# Altium project Flash Pmod.PrjPcb
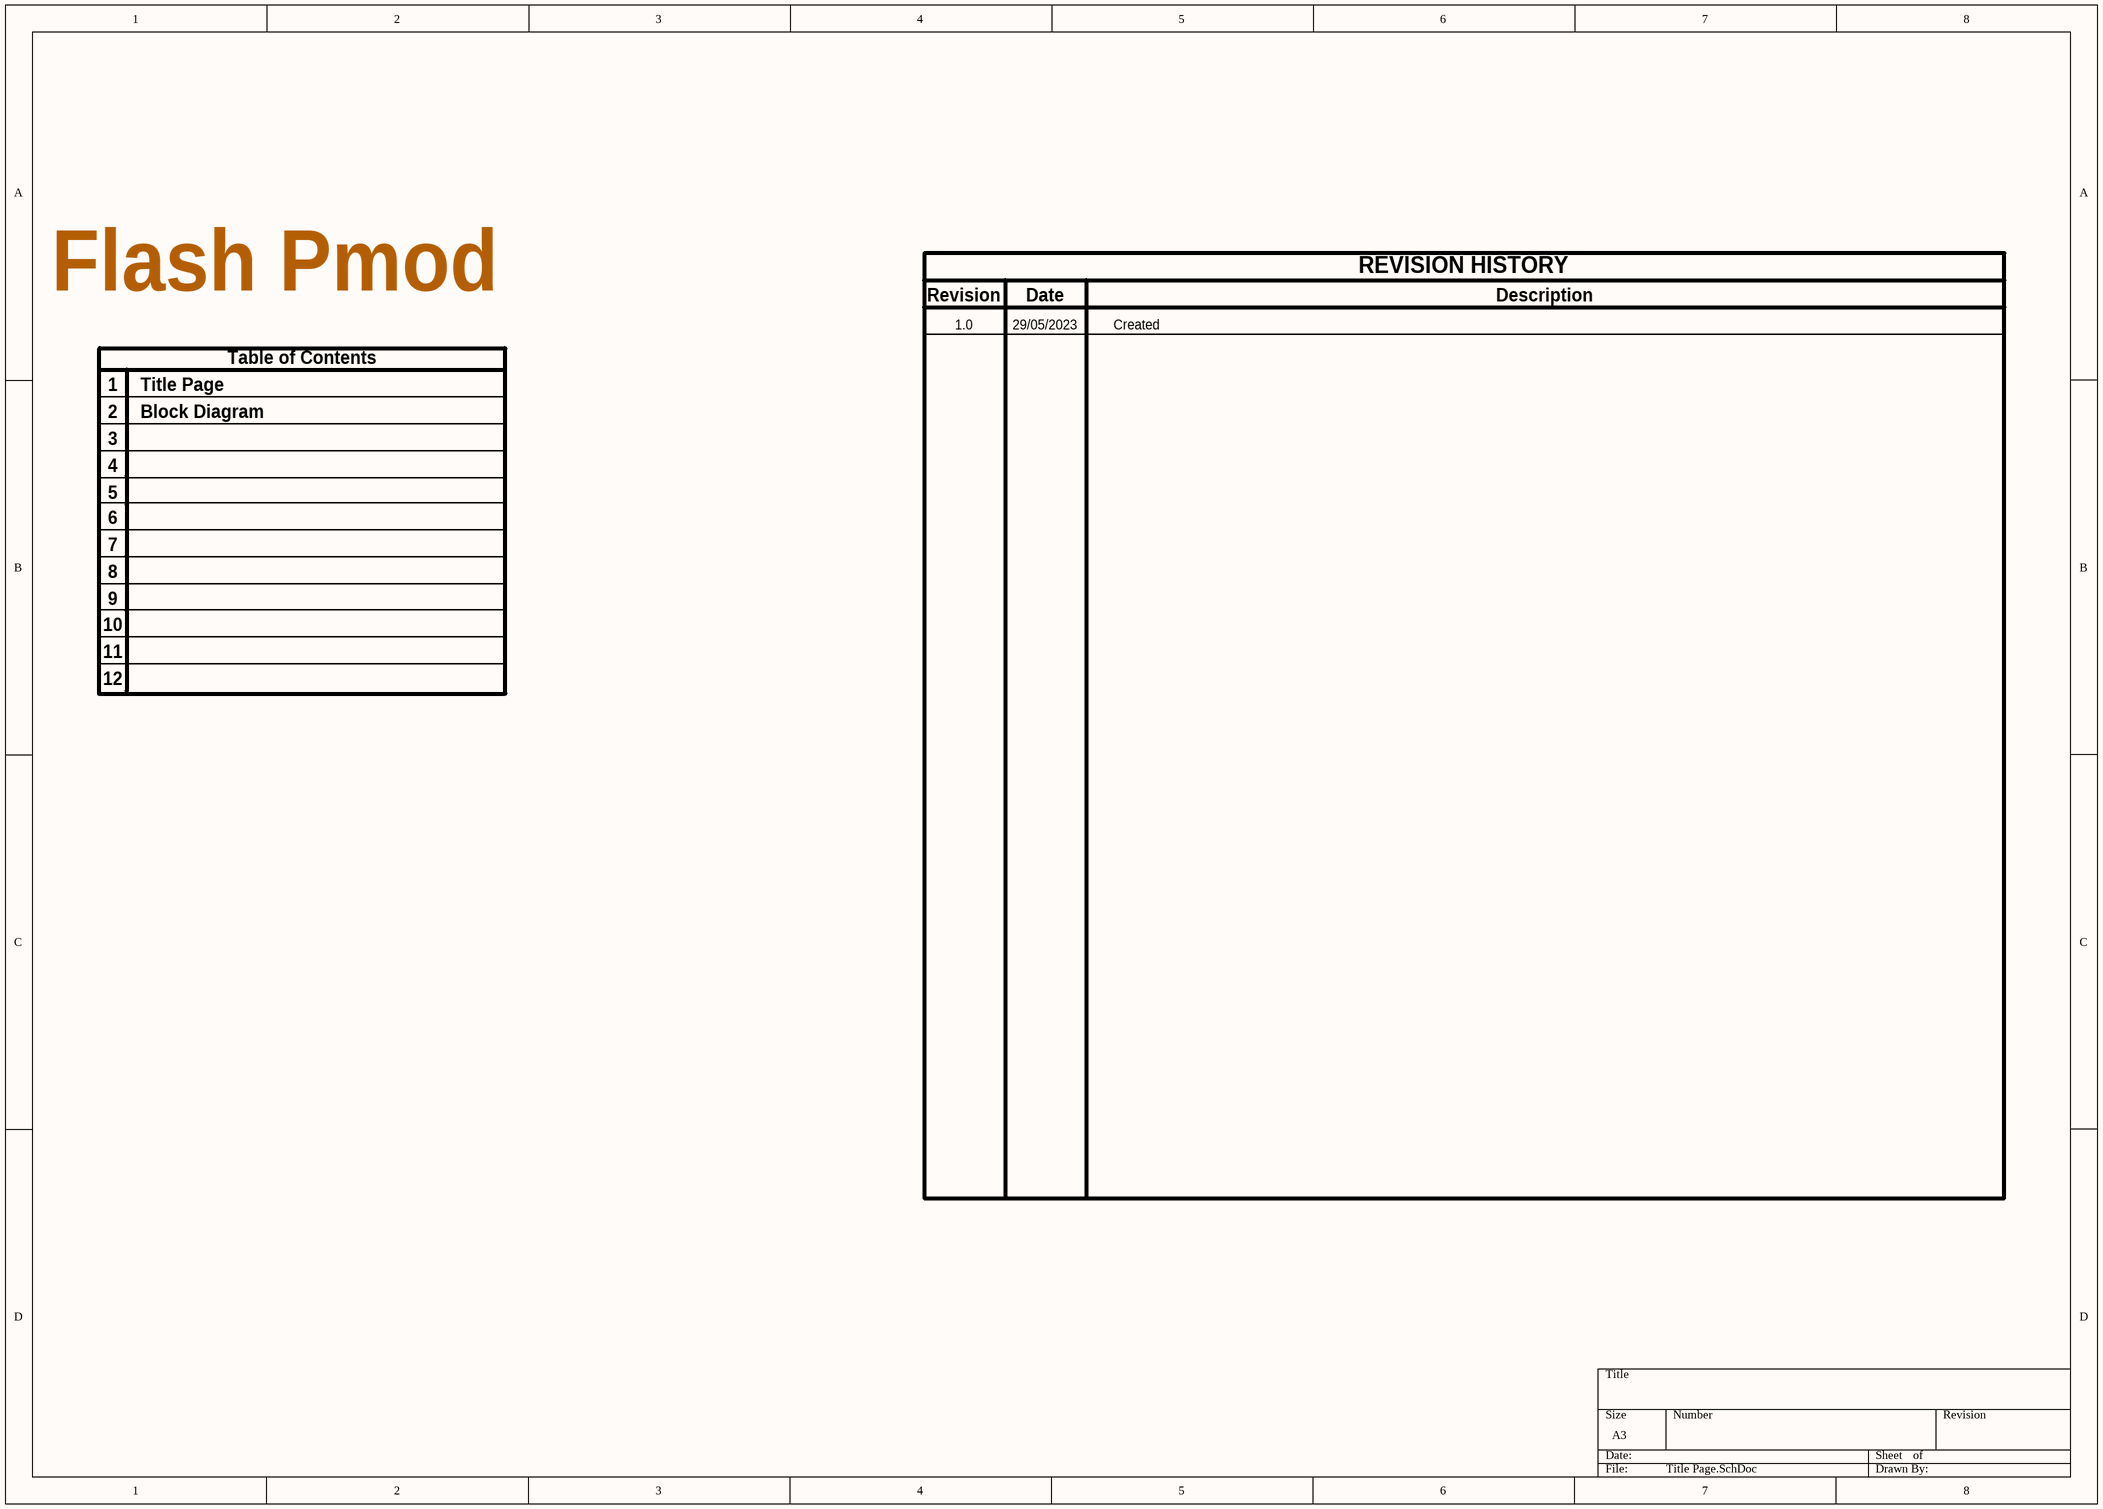
[diagram p0: Title Page.SchDoc]
2 sheets, 13 parts. Net scope: global (net labels, ports and power ports of the same name join across sheets).
Board file: Flash Pmod.PcbDoc
Sheets:
  Title Page.SchDoc
  Flash.SchDoc

## Sheet Title Page.SchDoc
size A3; SheetNumber: 1; SheetTotal: 2

### Notes on the sheet
- Flash Pmod
- Revision
- Date
- REVISION HISTORY
- Description
- Table of Contents
- 1.0
- 29/05/2023
- Created
- 1
- 2
- 3
- Title Page
- Block Diagram
- 4
- 5
- 6
- 7
- 8
- 9
- 10
- 11
- 12

## Sheet Flash.SchDoc
size A3; SheetNumber: 2; SheetTotal: 2
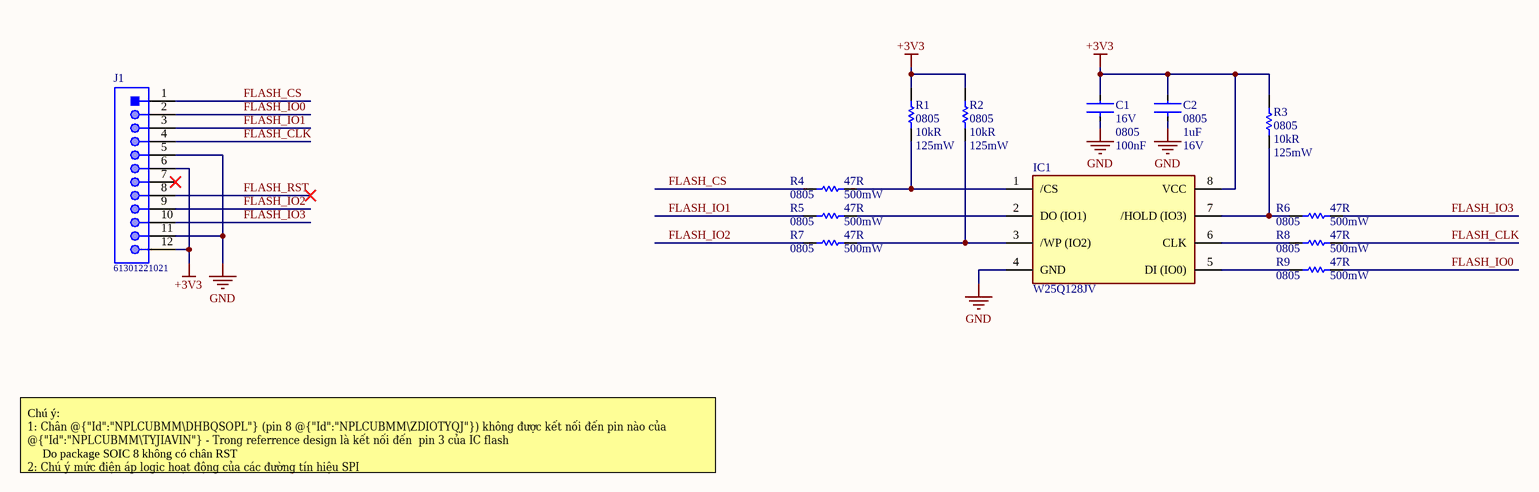
[diagram p1: Flash.SchDoc]

### Parts
C1  Voltage Rating: 16V  Case Code (Imperial): 0805  Capacitance: 100nF  [FP-0805-L_2_01_0_2-W_1_25-IPC_B]  (hidden comment: 08051C104KAT2A)
C2  value 1uF  Case/Package: 0805  Voltage Rating: 16V  [FP-0805-L_2_01_0_2-W_1_25-IPC_B]  (hidden comment: C0805C105K4PACTU)
IC1  W25Q128JV  [SOIC127P790X216-8N]
J1  61301221021  [61301221021]
R1  value 10kR  Case/Package: 0805  Power Rating: 125mW  [RESC2013X70X40LL20T20]  (hidden comment: RC0805FR-0710KL)
R2  value 10kR  Case/Package: 0805  Power Rating: 125mW  [RESC2013X70X40LL20T20]  (hidden comment: RC0805FR-0710KL)
R3  value 10kR  Case/Package: 0805  Power Rating: 125mW  [RESC2013X70X40LL20T20]  (hidden comment: RC0805FR-0710KL)
R4  value 47R  Case Code (Imperial): 0805  Power Rating: 500mW  [RESC2013X70X40LL20T20]  (hidden comment: ERJ-P6WF47R0V)
R5  value 47R  Case Code (Imperial): 0805  Power Rating: 500mW  [RESC2013X70X40LL20T20]  (hidden comment: ERJ-P6WF47R0V)
R6  value 47R  Case Code (Imperial): 0805  Power Rating: 500mW  [RESC2013X70X40LL20T20]  (hidden comment: ERJ-P6WF47R0V)
R7  value 47R  Case Code (Imperial): 0805  Power Rating: 500mW  [RESC2013X70X40LL20T20]  (hidden comment: ERJ-P6WF47R0V)
R8  value 47R  Case Code (Imperial): 0805  Power Rating: 500mW  [RESC2013X70X40LL20T20]  (hidden comment: ERJ-P6WF47R0V)
R9  value 47R  Case Code (Imperial): 0805  Power Rating: 500mW  [RESC2013X70X40LL20T20]  (hidden comment: ERJ-P6WF47R0V)

### Nets
+3V3: C1.2 C2.2 IC1.8(VCC) J1.6 J1.12 R1.1 R2.1 R3.1
GND: C1.1 C2.1 IC1.4(GND) J1.5 J1.11
FLASH_CLK: J1.4 R8.1
FLASH_CS: J1.1 R4.2
FLASH_IO0: J1.2 R9.1
FLASH_IO1: J1.3 R5.2
FLASH_IO2: J1.9 R7.2
FLASH_IO3: J1.10 R6.1
FLASH_RST: J1.8
NetIC1_1: IC1.1(/CS) R1.2 R4.1
NetIC1_2: IC1.2(DO_(IO1)) R5.1
NetIC1_3: IC1.3(/WP_(IO2)) R2.2 R7.1
NetIC1_5: IC1.5(DI_(IO0)) R9.2
NetIC1_6: IC1.6(CLK) R8.2
NetIC1_7: IC1.7(/HOLD_(IO3)) R3.2 R6.2

Not connected (* = marked no-connect by the designer): J1 7*

### Notes on the sheet
- Chú ý:
  1: Chân @{"Id":"NPLCUBMM\DHBQSOPL"} (pin 8 @{"Id":"NPLCUBMM\ZDIOTYQJ"}) không được kết nối đến pin nào của @{"Id":"NPLCUBMM\TYJIAVIN"} - Trong referrence design là kết nối đến  pin 3 của IC flash
  Do package SOIC 8 không có chân RST
  2: Chú ý mức điện áp logic hoạt động của các đường tín hiệu SPI

### Library data of the parts
C1 = CMP-2007-04174-2: General Purpose Ceramic Capacitor, 0805, 100nF, 10%, X7R, 15%, 100V; Manufacturer: Kyocera AVX; Packaging: Tape and Reel; Min Operating Temperature: -55°C; Dielectric Material: Ceramic; Height: 1.4mm; Termination: SMD/SMT; Case Code (Metric): 2012; Case/Package: 0805; Construction: Flat; Radiation Hardening: No; Series: -; Dielectric: X7R; Package Quantity: 2000; Mount: Surface Mount; Contact Plating: Tin; Voltage: 100V; Lead Free: Lead Free; Depth: 1.25mm; RoHS Compliant: Yes; Number of Pins: 2; Max Operating Temperature: 125°C; Length: 2.01mm; Voltage Rating (DC): 100V; Thickness: 0.055inch; REACH SVHC: No SVHC; Width: 0.049inch; Tolerance: 10%; Supplier: Digi-Key; Supplier Part Number: 478-5028-1-ND; Manufacturer Part Number: 08051C104KAT2A; RoHS: Yes; Category: Ceramic Capacitors; Stock: 469390; Pricing: 1=0,14, 10=0,103, 50=0,0584, 100=0,0483, 500=0,03388, 1000=0,02805 (USD); Mounting Technology: Surface Mount,PCB; Pins: 2; Value: 100nF; Reach SVHC Compliant: No
C2 = CMP-2007-04174-2: General Purpose Ceramic Capacitor, 0805, 100nF, 10%, X7R, 15%, 100V; Manufacturer: KEMET; Dielectric: X5R; Dissipation Factor: 5%; Supplier: Digi-Key; Supplier Part Number: 399-C0805C105K4PAC7800CT-ND; Manufacturer Part Number: C0805C105K4PACTU; RoHS: Yes; Category: Ceramic Capacitors; Stock: 66614; Pricing: 1=0,2, 10=0,136, 50=0,0814, 100=0,0687, 500=0,047, 1000=0,04158 (USD); Mounting Technology: Surface Mount,PCB; Case Code (Metric): 2012; Case Code (Imperial): 0805; Dielectric Material: Ceramic; Min Operating Temperature: -55°C; Max Operating Temperature: 85°C; Tolerance: 10%; Packaging: Tape and Reel; Termination: SMD/SMT; Series: C0805C; Voltage Rating (DC): 16V; Voltage: 16V; Package Quantity: 2500; Construction: Flat; Length: 2mm; Width: 1.2mm; Height: 1.25mm; Depth: 1.25mm; Thickness: 0.055inch; Radiation Hardening: No; Reach SVHC Compliant: No; RoHS Compliant: Yes; Lead Free: Lead Free
IC1 = W25Q128JVSIM_TR: Integrated Circuit; Manufacturer_Name: Winbond; Manufacturer_Part_Number: W25Q128JVSIM TR; Datasheet Link: http://www.winbond.com/resource-files/w25q128jv%20dtr%20revb%2011042016.pdf; Height: 2.16mm; Mouser Part Number: 454-W25Q128JVSIMTR; Mouser Price/Stock: https://www.mouser.co.uk/ProductDetail/Winbond/W25Q128JVSIM-TR?qs=qSfuJ%252Bfl%2Fd6ji9IuruL6Zg%3D%3D; Arrow Part Number: W25Q128JVSIM TR; Arrow Price/Stock: https://www.arrow.com/en/products/w25q128jvsimtr/winbond-electronics?region=nac
J1 = CMP-1502-01087-1: THT Angled Pin Header WR-PHD, Pitch 2.54 mm, Dual Row, 12 pins; Manufacturer: Wurth Electronics; Pitch: 2.54mm; Gender: Male; Pin Number: 12; Working Voltage: 250VAC; Withstanding Voltage: 500VAC; Contact Resistance: 20mOhm; Rated Current: 3A; Voltage Rating: 250V; Datasheet URL: https://katalog.we-online.de/em/datasheet/6130xx21021.pdf; Orientation: Angled; Package Reference: 61301221021; Operating Temperature: -40to105degC; Part Number: 61301221021; Mounting Technology: THT; Row Number: Dual; Publisher: WurthElektronik; Packaging: Bag; Manufacturer URL: http://www.we-online.de; Supplier: Digi-Key; Supplier Part Number: 732-5354-ND; Manufacturer Part Number: 61301221021; RoHS: Yes; Category: Connectors; Stock: 2535; Pricing: 1=0,96, 10=0,817, 25=0,6812, 50=0,568, 100=0,516, 1000=0,469 (USD); Contact Plating: Gold; Contact Material: Copper Alloy,Copper; Contact Shape: Square; Contact Finish - Mating: GOLD; Insulation Material: Nylon; Insulation Color: Black; Min Operating Temperature: -40°C; Max Operating Temperature: 105°C; Number of Rows: 2; Number of Positions: 12; Termination: Solder; Number of Contacts: 12; Connector Type: Header; Fastening Type: Pull; Series: WR-PHD; Contact Type: Male Pin; RoHS Compliant: Yes; Flammability Rating: UL94 V-0; Reach SVHC Compliant: Unknown; ComponentLink1URL: http://www.farnell.com/cad/1737270.pdf?src-supplier=Element14; ComponentLink1Description: http://www.farnell.com/cad/1737270.pdf?src-supplier=Element14; ComponentLink2URL: https://katalog.we-online.de/em/datasheet/6130xx21021.pdf?src-supplier=Digi-Key; ComponentLink2Description: https://katalog.we-online.de/em/datasheet/6130xx21021.pdf?src-supplier=Digi-Key
R1-R3 = CMP-2001-00486-1: 10 kOhms ±1% 0.125W, 1/8W Chip Resistor 0805 (2012 Metric) Moisture Resistant Thick Film; Manufacturer: Yageo; Voltage Rating: 150V; Temperature Coefficient: 100ppm/°C; Supplier: Digi-Key; Supplier Part Number: 311-10.0KCRCT-ND; Manufacturer Part Number: RC0805FR-0710KL; RoHS: Yes; Category: Chip SMD Resistors; Stock: 9862859; Pricing: 1=0,1, 10=0,027, 50=0,017, 100=0,0143, 500=0,00986, 1000=0,00852 (USD); Case Code (Imperial): 0805; Case Code (Metric): 2012; Min Operating Temperature: -55°C; Max Operating Temperature: 155°C; Packaging: Tape and Reel; Tolerance: 1%; Termination: SMD/SMT; Series: RC; Package Quantity: 1; Resistor Type: Thick Film; Number of Terminations: 2; Max Power Dissipation: 125mW; Features: Moisture Resistant; Construction: Rectangular; Resistance Tolerance: 1%; Technology: THICK FILM; Length: 0.079inch; Width: 0.049inch; Height: 0.024inch; Depth: 1.25mm; RoHS Compliant: Yes; Military Standard: Not; Lead Free: Lead Free; Reach SVHC Compliant: Unknown; ComponentLink1URL: https://datasheet.ciiva.com/11808/0900766b8106beab-11808151.pdf?src-supplier=Rs; ComponentLink1Description: https://datasheet.ciiva.com/11808/0900766b8106beab-11808151.pdf?src-supplier=Rs; ComponentLink2URL: https://datasheet.ciiva.com/46447/444164-46447563.pdf?src-supplier=Element14; ComponentLink2Description: https://datasheet.ciiva.com/46447/444164-46447563.pdf?src-supplier=Element14; ComponentLink3URL: https://datasheet.ciiva.com/2456/pyu-r-int-thick-7-2456973.pdf?src-supplier=Digi-Key; ComponentLink3Description: https://datasheet.ciiva.com/2456/pyu-r-int-thick-7-2456973.pdf?src-supplier=Digi-Key; ComponentLink4URL: https://datasheet.ciiva.com/2456/pyu-r-int-thick-7-2456974.pdf?src-supplier=Digi-Key; ComponentLink4Description: https://datasheet.ciiva.com/2456/pyu-r-int-thick-7-2456974.pdf?src-supplier=Digi-Key; ComponentLink5URL: https://datasheet.ciiva.com/2456/pyu-r-int-thick-7-2456972.pdf?src-supplier=Digi-Key; ComponentLink5Description: https://datasheet.ciiva.com/2456/pyu-r-int-thick-7-2456972.pdf?src-supplier=Digi-Key; ComponentLink6URL: https://datasheet.ciiva.com/12669/rc0805-12669688.pdf?src-supplier=Mouser; ComponentLink6Description: https://datasheet.ciiva.com/12669/rc0805-12669688.pdf?src-supplier=Mouser; ComponentLink7URL: https://datasheet.ciiva.com/16747/rc0805-16747087.pdf?src-supplier=Future+Electronics; ComponentLink7Description: https://datasheet.ciiva.com/16747/rc0805-16747087.pdf?src-supplier=Future+Electronics
R4-R9 = CMP-2001-00486-1: 47 Ohms ±1% 0.5W, 1/2W Chip Resistor 0805 (2012 Metric) Automotive AEC-Q200, Pulse Withstanding Thick Film; Manufacturer: Panasonic; Temperature Coefficient: 200ppm/°C; Voltage Rating: 150V; Supplier: Digi-Key; Supplier Part Number: P16869CT-ND; Manufacturer Part Number: ERJ-P6WF47R0V; RoHS: Yes; Category: Chip SMD Resistors; Stock: 32493; Pricing: 1=0,57, 10=0,438, 50=0,2474, 100=0,184, 500=0,13326, 1000=0,10153 (USD); Case/Package: 0805; Case Code (Metric): 2012; Min Operating Temperature: -55°C; Max Operating Temperature: 155°C; Tolerance: 1%; Packaging: Cut Tape; Series: ERJ; Number of Terminations: 2; Termination: Flat; Max Power Dissipation: 500mW; Voltage Rating (DC): 150V; Features: Automotive AEC-Q200; Resistor Type: Thick Film; Technology: THICK FILM; Resistance Tolerance: 1%; Length: 2mm; Height: 0.65mm; Depth: 1.25mm; Ratings: AEC-Q200; RoHS Compliant: Yes; Reach SVHC Compliant: No; ComponentLink1URL: https://datasheet.ciiva.com/48536/erjp-series-eng-tds-48536489.pdf?src-supplier=Distrelec; ComponentLink1Description: https://datasheet.ciiva.com/48536/erjp-series-eng-tds-48536489.pdf?src-supplier=Distrelec; ComponentLink2URL: https://datasheet.ciiva.com/6082/1790600-6082415.pdf?src-supplier=Farnell; ComponentLink2Description: https://datasheet.ciiva.com/6082/1790600-6082415.pdf?src-supplier=Farnell; ComponentLink3URL: https://datasheet.ciiva.com/7886/1790600-7886918.pdf?src-supplier=Element14; ComponentLink3Description: https://datasheet.ciiva.com/7886/1790600-7886918.pdf?src-supplier=Element14; ComponentLink4URL: https://datasheet.ciiva.com/48531/aoa0000ce4-48531642.pdf?src-supplier=Avnet; ComponentLink4Description: https://datasheet.ciiva.com/48531/aoa0000ce4-48531642.pdf?src-supplier=Avnet